# Altium project Invertor_controller_v2.PrjPcb (part 2 of 3)

## Sheet Power.SchDoc
size A4
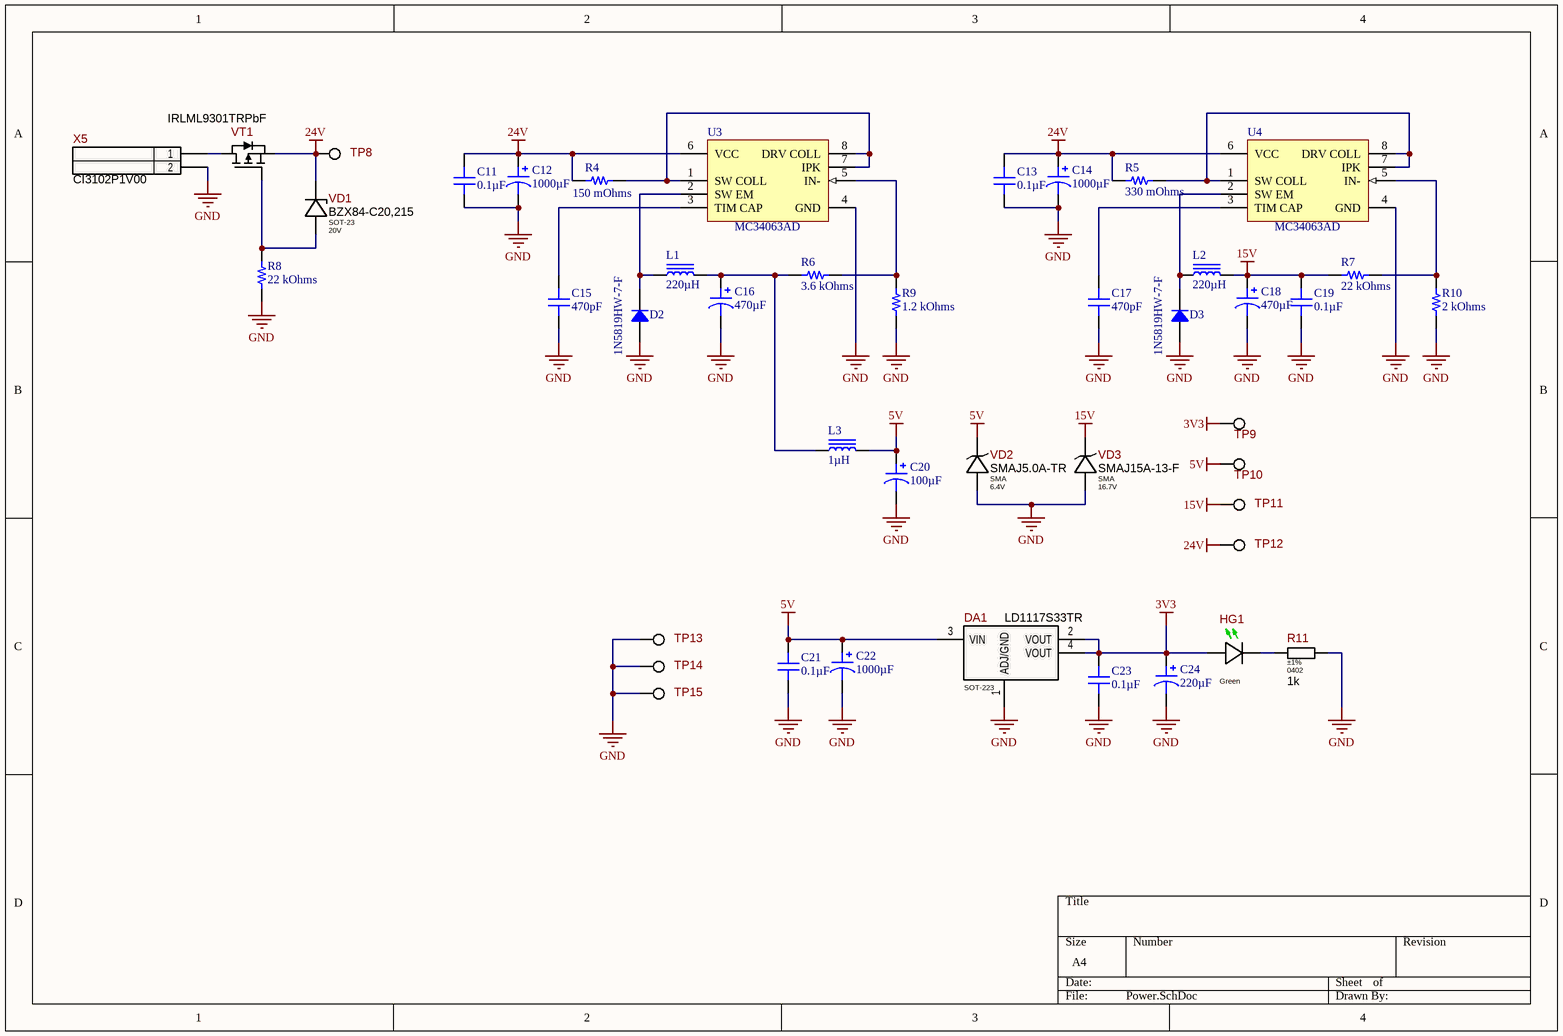
[diagram p3: Power.SchDoc]

### Parts
C11  0.1µF  [CAP 0805_2012]
C12  1000µF  [CAP TH ALUM ELEC D22.00mm S10.00mm H27.00mm]
C13  0.1µF  [CAP 0805_2012]
C14  1000µF  [CAP TH ALUM ELEC D22.00mm S10.00mm H27.00mm]
C15  470pF  [CAP 0805_2012]
C16  470µF  [CAP TH ALUM ELEC D8.00mm S3.50mm H12.50mm]
C17  470pF  [CAP 0805_2012]
C18  470µF  [CAP TH ALUM ELEC D8.00mm S3.50mm H12.50mm]
C19  0.1µF  [CAP 0805_2012]
C20  100µF  [CAP ALSMD 5.3MM H5.4MM]
C21  0.1µF  [CAP 0805_2012]
C22  1000µF  [CAP TH ALUM ELEC D22.00mm S10.00mm H27.00mm]
C23  0.1µF  [CAP 0805_2012]
C24  220µF  [CAP ALSMD POLY 5.3MM H6.0MM]
D2  1N5819HW-7-F  [SOD-123]
D3  1N5819HW-7-F  [SOD-123]
DA1  LD1117S33TR  [SOT-223]
HG1  Color: Green  [LED-0603G-0.8mm]  (hidden comment: 19-21/GHC-YR1S2/3T)
L1  220µH  [BOURNS SRR1280]
L2  220µH  [BOURNS SRR1280]
L3  1µH  [TAIYO YUDEN NRS5030]
R4  150 mOhms  [RES 1206_3216]
R5  330 mOhms  [RES 1206_3216]
R6  3.6 kOhms  [RES 0805_2012]
R7  22 kOhms  [RES 0805_2012]
R8  22 kOhms  [RES 0805_2012]
R9  1.2 kOhms  [RES 0805_2012]
R10  2 kOhms  [RES 0805_2012]
R11  Tolerance: ±1%  Package: 0402  [R_ANY_CHIP_0402_MED]  (hidden comment: 1k)
TP8  PAD-1.1mm  [PAD-1.1mm]  (value not drawn)  (no BOM)
TP9  PAD-1.1mm  [PAD-1.1mm]  (value not drawn)  (no BOM)
TP10  PAD-1.1mm  [PAD-1.1mm]  (value not drawn)  (no BOM)
TP11  PAD-1.1mm  [PAD-1.1mm]  (value not drawn)  (no BOM)
TP12  PAD-1.1mm  [PAD-1.1mm]  (value not drawn)  (no BOM)
TP13  PAD-1.1mm  [PAD-1.1mm]  (value not drawn)  (no BOM)
TP14  PAD-1.1mm  [PAD-1.1mm]  (value not drawn)  (no BOM)
TP15  PAD-1.1mm  [PAD-1.1mm]  (value not drawn)  (no BOM)
U3  MC34063AD  [751-05_N]
U4  MC34063AD  [751-05_N]
VD1  Package: SOT-23  Voltage: 20V  [SOT-23_MED]  (hidden comment: BZX84-C20,215)
VD2  Package: SMA  Voltage: 6.4V  [SMA_MED]  (hidden comment: SMAJ5.0A)
VD3  Package: SMA  Voltage: 16.7V  [SMA_MED]  (hidden comment: SMAJ15A)
VT1  IRLML9301TRPbF  [SOT-23_MED]
X5  WH-02S  [WF-2S]  (value not drawn)

### Nets
3V3: C23.2 C24.1 DA1.2(VOUT) DA1.4(VOUT) HG1.AN(Anode) TP9.1
5V: C20.1 C21.2 C22.1 DA1.3(VIN) L3.2 TP10.1 VD2.CA  [project net PCF_VCC]
15V: C18.1 C19.2 L2.2 R7.1 TP11.1 VD3.CA
24V: C11.2 C12.1 C13.2 C14.1 R4.1 R5.1 TP8.1 TP12.1 U3.6(VCC) U4.6(VCC) VD1.3(Cathode) VT1.2(S)
GND: C11.1 C12.2 C13.1 C14.2 C15.1 C16.2 C17.1 C18.2 C19.1 C20.2 C21.1 C22.2 C23.1 C24.2 D2.1 D3.1 DA1.1(ADJ/GND) R8.1 R9.1 R10.1 R11.2 TP13.1 TP14.1 TP15.1 U3.4(GND) U4.4(GND) VD2.AN VD3.AN X5.2
NetC15_2: C15.2 U3.3(TIM_CAP)
NetC16_1: C16.1 L1.2 L3.1 R6.1
NetC17_2: C17.2 U4.3(TIM_CAP)
NetD2_2: D2.2 L1.1 U3.2(SW_EM)
NetD3_2: D3.2 L2.1 U4.2(SW_EM)
NetHG1_CA: HG1.CA(Cathode) R11.1
NetR4_2: R4.2 U3.1(SW_COLL) U3.7(IPK) U3.8(DRV_COLL)
NetR5_2: R5.2 U4.1(SW_COLL) U4.7(IPK) U4.8(DRV_COLL)
NetR6_2: R6.2 R9.2 U3.5(IN-)
NetR7_2: R7.2 R10.2 U4.5(IN-)
NetR8_2: R8.2 VD1.1(Anode) VT1.1(G)
NetVT1_3: VT1.3(D) X5.1

Not connected (* = marked no-connect by the designer): VD1 2(NC)

### Library data of the parts
C11 C13 C19 C21 C23 = CC0805MRX7R9BB104: CAP CER 0.1UF 50V X7R 0805; Manufacturer: Yageo; Tolerance: ±20%; Part Number: CC0805MRX7R9BB104; Value: 0.1µF; Applications: General Purpose; Capacitance: 0.1µF; ComponentLink1Description: Datasheet; ComponentLink1URL: https://www.yageo.com/upload/media/product/productsearch/datasheet/mlcc/UPY-GPHC_X7R_6.3V-to-50V_18.pdf; ComponentLink2Description: DigiKey Link; ComponentLink2URL: http://digikey.com/product-detail/en/yageo/CC0805MRX7R9BB104/311-4351-1-ND/8025440; Device Package: 0805 (2012 Metric); LastUpdated: 02.09.2020 01:04:42; Lifecycle Status: Active; Minimum Order: 1; Mounting Type: Surface Mount, MLCC; Operating Temperature: -55°C ~ 125°C; Package / Case: 0805 (2012 Metric); Packaging: TapeAndReel; PartId: 2475; Part Status: Active; Price: 0.02; Series: CC; Size / Dimension: 0.079" L x 0.049" W (2.00mm x 1.25mm); Supplier 1: DigiKey; Supplier Part Number 1: 311-4351-1-ND; Temperature Coefficient: X7R; Thickness (Max): 0.037" (0.95mm); Voltage - Rated: 50V
C12 C14 C22 = LKG1V102MESZCK: CAP ALUM 1000UF 20% 35V SNAP IN; Manufacturer: Nichicon; Lifetime @ Temp.: 1000 Hrs @ 85°C; Polarization: Polar; Ripple Current @ Low Frequency: 1A @ 120Hz; Part Number: LKG1V102MESZCK; Applications: Audio; Capacitance: 1000µF; ComponentLink1Description: Datasheet; ComponentLink1URL: http://nichicon-us.com/english/products/pdfs/e-lkg.pdf; ComponentLink2Description: DigiKey Link; ComponentLink2URL: http://digikey.com/product-detail/en/nichicon/LKG1V102MESZCK/493-17542-ND/7698947; Device Package: Radial, Can - Snap-In; Height - Seated (Max): 1.063" (27.00mm); LastUpdated: 02.09.2020 01:30:15; Lead Spacing: 0.394" (10.00mm); Lifecycle Status: Active; Minimum Order: 1; Mounting Type: Through Hole; Operating Temperature: -40°C ~ 85°C; Package / Case: Radial, Can - Snap-In; Packaging: Bulk; PartId: 10430; Part Status: Active; Price: 4.27; Series: LKG; Size / Dimension: 0.866" Dia (22.00mm); Supplier 1: DigiKey; Supplier Part Number 1: 493-17542-ND; Tolerance: ±20%; Value: 1000µF; Voltage - Rated: 35V
C15 C17 = C0805X471J5HACAUTO: CAP CER 0805 470PF 50V ULTRA STA; Manufacturer: KEMET; Temperature Coefficient: X8R; Tolerance: ±5%; Part Number: C0805X471J5HACAUTO; Value: 470pF; Applications: Automotive, Boardflex Sensitive; Capacitance: 470pF; ComponentLink1Description: Datasheet; ComponentLink1URL: https://api.kemet.com/component-edge/download/datasheet/C0805X471J5HACAUTO.pdf; ComponentLink2Description: DigiKey Link; ComponentLink2URL: http://digikey.com/product-detail/en/kemet/C0805X471J5HACAUTO/399-16874-1-ND/8324471; Device Package: 0805 (2012 Metric); Features: Low ESL, Soft Termination, High Temperature; LastUpdated: 02.09.2020 01:04:33; Lifecycle Status: Active; Minimum Order: 1; Mounting Type: Surface Mount, MLCC; Operating Temperature: -55°C ~ 150°C; Package / Case: 0805 (2012 Metric); Packaging: TapeAndReel; PartId: 7274; Part Status: Active; Price: 0.04; Ratings: AEC-Q200; Series: SMD Auto X8R HT150C Flex; Size / Dimension: 0.079" L x 0.049" W (2.00mm x 1.25mm); Supplier 1: DigiKey; Supplier Part Number 1: 399-16874-1-ND; Thickness (Max): 0.039" (0.98mm); Voltage - Rated: 50V
C16 C18 = ECA-1AHG471: CAP ALUM 470UF 20% 10V RADIAL; Manufacturer: Panasonic Electronic Components; Lifetime @ Temp.: 1000 Hrs @ 105°C; Polarization: Polar; Ripple Current @ High Frequency: 375mA @ 100kHz; Ripple Current @ Low Frequency: 250mA @ 120Hz; Part Number: ECA-1AHG471; Applications: General Purpose; Capacitance: 470µF; ComponentLink1Description: Datasheet; ComponentLink1URL: https://industrial.panasonic.com/cdbs/www-data/pdf/RDF0000/ABA0000C1215.pdf; ComponentLink2Description: DigiKey Link; ComponentLink2URL: http://digikey.com/product-detail/en/panasonic-electronic-components/ECA-1AHG471/P5520-ND/245119; Device Package: Radial, Can; Height - Seated (Max): 0.492" (12.50mm); LastUpdated: 07.09.2020 05:24:51; Lead Spacing: 0.138" (3.50mm); Lifecycle Status: Active; Minimum Order: 1; Mounting Type: Through Hole; Operating Temperature: -55°C ~ 105°C; Package / Case: Radial, Can; Packaging: Bulk; PartId: 7234; Part Status: Active; Price: 0.43; Series: NHG; Size / Dimension: 0.315" Dia (8.00mm); Supplier 1: DigiKey; Supplier Part Number 1: P5520-ND; Tolerance: ±20%; Value: 470µF; Voltage - Rated: 10V
C20 = 865090142005: CAP 100 UF 20% 6.3 V; Manufacturer: Würth Elektronik; Lifetime @ Temp.: 1000 Hrs @ 85°C; Polarization: Polar; Ripple Current @ High Frequency: 105mA @ 100kHz; Ripple Current @ Low Frequency: 70mA @ 120Hz; Surface Mount Land Size: 0.209" L x 0.209" W (5.30mm x 5.30mm); Voltage - Rated: 6.3V; Part Number: 865090142005; Applications: General Purpose; Capacitance: 100µF; ComponentLink1Description: Datasheet; ComponentLink1URL: https://katalog.we-online.de/pbs/datasheet/865090142005.pdf; ComponentLink2Description: DigiKey Link; ComponentLink2URL: http://digikey.com/product-detail/en/w-rth-elektronik/865090142005/732-8389-1-ND/5728346; Device Package: Radial, Can - SMD; Height - Seated (Max): 0.217" (5.50mm); LastUpdated: 02.09.2020 01:25:23; Lifecycle Status: Active; Minimum Order: 1; Mounting Type: Surface Mount; Operating Temperature: -40°C ~ 85°C; Package / Case: Radial, Can - SMD; Packaging: TapeAndReel; PartId: 7916; Part Status: Active; Price: 0.14; Series: WCAP-ASLU; Size / Dimension: 0.197" Dia (5.00mm); Supplier 1: DigiKey; Supplier Part Number 1: 732-8389-1-ND; Tolerance: ±20%; Value: 100µF
C24 = 6SVPE220MW: CAP ALUM POLY 220UF 20% 6.3V SMD; Manufacturer: Panasonic Electronic Components; ESR (Equivalent Series Resistance): 15mOhm; Lifetime @ Temp.: 2000 Hrs @ 105°C; Ripple Current @ High Frequency: 3.15A @ 100kHz; Ripple Current @ Low Frequency: 157.5mA @ 120Hz; Surface Mount Land Size: 0.209" L x 0.209" W (5.30mm x 5.30mm); Type: Polymer; Part Number: 6SVPE220MW; Applications: General Purpose; Capacitance: 220µF; ComponentLink1Description: Datasheet; ComponentLink1URL: http://industrial.panasonic.com/www-cgi/jvcr13pz.cgi?E+CI+4+AAB8002+6SVPE220MW+8+WW; ComponentLink2Description: DigiKey Link; ComponentLink2URL: http://digikey.com/product-detail/en/panasonic-electronic-components/6SVPE220MW/P16836CT-ND/4834392; Device Package: Radial, Can - SMD; Height - Seated (Max): 0.236" (6.00mm); LastUpdated: 02.09.2020 01:22:07; Lifecycle Status: Active; Minimum Order: 1; Mounting Type: Surface Mount; Operating Temperature: -55°C ~ 105°C; Package / Case: Radial, Can - SMD; Packaging: TapeAndReel; PartId: 1960; Part Status: Active; Price: 0.20; Series: OS-CON™, SVPE; Size / Dimension: 0.197" Dia (5.00mm); Supplier 1: DigiKey; Supplier Part Number 1: P16836CT-ND; Tolerance: ±20%; Value: 220µF; Voltage - Rated: 6.3V
D2 D3 = 1N5819HW-7-F: DIODE SCHOTTKY 40V 1A SOD123; Manufacturer: Diodes Incorporated; Capacitance @ Vr, F: 60pF @ 4V, 1MHz; Current - Reverse Leakage @ Vr: 1mA @ 40V; Speed: Fast Recovery =< 500ns, > 200mA (Io); Voltage - Forward (Vf) (Max) @ If: 450mV @ 1A; Part Number: 1N5819HW-7-F; ComponentLink1Description: Datasheet; ComponentLink1URL: https://www.diodes.com/assets/Datasheets/ds30217.pdf; ComponentLink2Description: DigiKey Link; ComponentLink2URL: http://digikey.com/product-detail/en/diodes-incorporated/1N5819HW-7-F/1N5819HW-FDICT-ND/815283; Current - Average Rectified (Io): 1A; Diode Type: Schottky; LastUpdated: 02.09.2020 01:19:08; Lifecycle Status: Active; Minimum Order: 1; Mounting Type: Surface Mount; Operating Temperature - Junction: -65°C ~ 125°C; Package / Case: SOD-123; Packaging: TapeAndReel; PartId: 2212; Part Status: Active; Price: 0.08; Series: -; Supplier 1: DigiKey; Supplier Part Number 1: 1N5819HW-FDICT-ND; Supplier Device Package: SOD-123; Voltage - DC Reverse (Vr) (Max): 40V
DA1 = LD1117S33TR: Adjustable and fixed low drop positive voltage regulator, 3.3V 800mA; Manufacturer: STMicroelectronics; Standard Lead Time: 10 Weeks; Component Status: Released; Replacement: NONE; Package: SOT-223; Part Number: LD1117S33TR; Part Type: Power / Linear Regulator; Component Type: SMD; Lifecycle: Mass Production; Temperature Range: 0°C ~ 125°C; ComponentLink1URL: https://www.st.com/content/ccc/resource/technical/document/datasheet/99/3b/7d/91/91/51/4b/be/CD00000544.pdf/files/CD00000544.pdf/jcr:content/translations/en.CD00000544.pdf; Supplier 1: Digi-Key; Supplier Part Number 1: 497-1242-2-ND; ComponentLink1Description: Datasheet
HG1 = 19-21/GHC-YR1S2/3T: Indication LED, Green 528nm, Clear, SMD 0603, Vf 2.7-3.7V, 112 - 285mcd @ 20mA, 110°; Manufacturer: Everlight Electronics Co.,Ltd; Ajax_1C_PN: NONE; Component Status: Released; Part Type: LED; Component Type: SMD; Lifecycle: RND Only; Package: 0603; Wavelength: 528nm; Temperature Range: -40°C ~ 85°C; ComponentLink1URL: https://media.digikey.com/pdf/Data%20Sheets/Everlight%20PDFs/19-21-GHC-YR1S2-3T.pdf; Supplier 1: Digi-Key; Supplier Part Number 1: 19-21/GHC-YR1S2/3T-ND; Replacement: NONE; ComponentLink1Description: Datasheet
L1 L2 = SRR1280-221K: FIXED IND 220UH 1.6A 400MOHM SMD; Manufacturer: Bourns Inc.; Current - Saturation: 1.7A; DC Resistance (DCR): 400mOhm Max; Frequency - Self Resonant: 3.4MHz; Inductance Frequency - Test: 100kHz; Material - Core: Ferrite; Q @ Freq: 24 @ 796kHz; Shielding: Shielded; Tolerance: ±10%; Type: Wirewound; Part Number: SRR1280-221K; ComponentLink1Description: Datasheet; ComponentLink1URL: https://www.bourns.com/docs/Product-Datasheets/SRR1280.pdf; ComponentLink2Description: DigiKey Link; ComponentLink2URL: http://digikey.com/product-detail/en/bourns-inc/SRR1280-221K/SRR1280-221KLCT-ND/2127436; Current Rating (Amps): 1.6A; Device Package: Nonstandard; Height - Seated (Max): 0.315" (8.00mm); Inductance: 220µH; LastUpdated: 02.09.2020 01:22:10; Lifecycle Status: Active; Minimum Order: 1; Mounting Type: Surface Mount; Operating Temperature: -40°C ~ 125°C; Package / Case: Nonstandard; Packaging: TapeAndReel; PartId: 21; Part Status: Active; Price: 0.65; Series: SRR1280; Size / Dimension: 0.492" L x 0.492" W (12.50mm x 12.50mm); Supplier 1: DigiKey; Supplier Part Number 1: SRR1280-221KLCT-ND; Value: 220µH
L3 = NRS5030T1R0NMGJV: FIXED IND 1UH 4A 19.5 MOHM SMD; Manufacturer: Taiyo Yuden; Current - Saturation: 6.6A; DC Resistance (DCR): 19.5mOhm Max; Frequency - Self Resonant: 110MHz; Inductance Frequency - Test: 100kHz; Material - Core: Ferrite; Shielding: Shielded; Tolerance: ±30%; Type: Wirewound; Part Number: NRS5030T1R0NMGJV; ComponentLink1Description: Datasheet; ComponentLink1URL: https://ds.yuden.co.jp/TYCOMPAS/ut/detail?pn=NRS5030T1R0NMGJV  &u=M; ComponentLink2Description: DigiKey Link; ComponentLink2URL: http://digikey.com/product-detail/en/taiyo-yuden/NRS5030T1R0NMGJV/587-3601-1-ND/4694110; Current Rating (Amps): 4A; Device Package: Nonstandard; Height - Seated (Max): 0.118" (3.00mm); Inductance: 1µH; LastUpdated: 02.09.2020 01:28:54; Lifecycle Status: Active; Minimum Order: 1; Mounting Type: Surface Mount; Operating Temperature: -40°C ~ 125°C; Package / Case: Nonstandard; Packaging: TapeAndReel; PartId: 3403; Part Status: Active; Price: 0.27; Ratings: AEC-Q200; Series: NR, S Type; Size / Dimension: 0.193" L x 0.193" W (4.90mm x 4.90mm); Supplier 1: DigiKey; Supplier Part Number 1: 587-3601-1-ND; Value: 1µH
R4 = WSL1206R1500FEA: RES 0.15 OHM 1% 1/4W 1206; Manufacturer: Vishay Dale; Power (Watts): 0.25W, 1/4W; Temperature Coefficient: ±75ppm/°C; Part Number: WSL1206R1500FEA; ComponentLink1Description: Datasheet; ComponentLink1URL: http://www.vishay.com/docs/30100/wsl.pdf; ComponentLink2Description: DigiKey Link; ComponentLink2URL: http://digikey.com/product-detail/en/vishay-dale/WSL1206R1500FEA/WSLC-.15CT-ND/713434; Composition: Metal Element; Device Package: 1206 (3216 Metric); Features: Anti-Sulfur, Automotive AEC-Q200, Current Sense, Moisture Resistant, Pulse Withstanding; Height - Seated (Max): 0.035" (0.89mm); LastUpdated: 02.09.2020 01:12:45; Lifecycle Status: Active; Minimum Order: 1; Number of Terminations: 2; Operating Temperature: -65°C ~ 170°C; Package / Case: 1206 (3216 Metric); Packaging: TapeAndReel; PartId: 37214; Part Status: Active; Price: 0.25; Ratings: AEC-Q200; Resistance: 150 mOhms; Series: WSL; Size / Dimension: 0.126" L x 0.063" W (3.20mm x 1.60mm); Supplier 1: DigiKey; Supplier Part Number 1: WSLC-.15CT-ND; Supplier Device Package: 1206; Tolerance: ±1%; Value: 150 mOhms
R5 = ERJ-8RQFR33V: RES 0.33 OHM 1% 1/4W 1206; Manufacturer: Panasonic Electronic Components; Power (Watts): 0.25W, 1/4W; Temperature Coefficient: ±250ppm/°C; Part Number: ERJ-8RQFR33V; ComponentLink1Description: Datasheet; ComponentLink1URL: https://industrial.panasonic.com/cdbs/www-data/pdf/RDN0000/AOA0000C313.pdf; ComponentLink2Description: DigiKey Link; ComponentLink2URL: http://digikey.com/product-detail/en/panasonic-electronic-components/ERJ-8RQFR33V/P.33RCT-ND/250350; Composition: Thick Film; Device Package: 1206 (3216 Metric); Features: Automotive AEC-Q200, Current Sense; Height - Seated (Max): 0.028" (0.70mm); LastUpdated: 02.09.2020 01:13:10; Lifecycle Status: Active; Minimum Order: 1; Number of Terminations: 2; Operating Temperature: -55°C ~ 125°C; Package / Case: 1206 (3216 Metric); Packaging: TapeAndReel; PartId: 26973; Part Status: Active; Price: 0.04; Ratings: AEC-Q200; Resistance: 330 mOhms; Series: ERJ; Size / Dimension: 0.126" L x 0.063" W (3.20mm x 1.60mm); Supplier 1: DigiKey; Supplier Part Number 1: P.33RCT-ND; Supplier Device Package: 1206; Tolerance: ±1%; Value: 330 mOhms
R6 = RMCF0805FT3K60: RES 3.6K OHM 1% 1/8W 0805; Manufacturer: Stackpole Electronics Inc; Power (Watts): 0.125W, 1/8W; Temperature Coefficient: ±100ppm/°C; Part Number: RMCF0805FT3K60; Value: 3.6 kOhms; ComponentLink1Description: Datasheet; ComponentLink1URL: https://www.seielect.com/catalog/sei-rmcf_rmcp.pdf; ComponentLink2Description: DigiKey Link; ComponentLink2URL: http://digikey.com/product-detail/en/stackpole-electronics-inc/RMCF0805FT3K60/RMCF0805FT3K60CT-ND/2418390; Composition: Thick Film; Device Package: 0805 (2012 Metric); Features: Automotive AEC-Q200; Height - Seated (Max): 0.026" (0.65mm); LastUpdated: 02.09.2020 01:15:14; Lifecycle Status: Active; Minimum Order: 1; Number of Terminations: 2; Operating Temperature: -55°C ~ 155°C; Package / Case: 0805 (2012 Metric); Packaging: CutTape; PartId: 32503; Part Status: Active; Price: 0.10; Ratings: AEC-Q200; Resistance: 3.6 kOhms; Series: RMCF; Size / Dimension: 0.079" L x 0.049" W (2.00mm x 1.25mm); Supplier 1: DigiKey; Supplier Part Number 1: RMCF0805FT3K60CT-ND; Supplier Device Package: 0805; Tolerance: ±1%
R7 R8 = ERA-6AED223V: RES 22K OHM 0.5% 1/8W 0805; Manufacturer: Panasonic Electronic Components; Power (Watts): 0.125W, 1/8W; Temperature Coefficient: ±25ppm/°C; Part Number: ERA-6AED223V; Value: 22 kOhms; ComponentLink1Description: Datasheet; ComponentLink1URL: https://industrial.panasonic.com/cdbs/www-data/pdf/RDM0000/AOA0000C307.pdf; ComponentLink2Description: DigiKey Link; ComponentLink2URL: http://digikey.com/product-detail/en/panasonic-electronic-components/ERA-6AED223V/P123824CT-ND/9467753; Composition: Thin Film; Device Package: 0805 (2012 Metric); Features: Automotive AEC-Q200; Height - Seated (Max): 0.024" (0.60mm); LastUpdated: 02.09.2020 01:15:15; Lifecycle Status: Active; Minimum Order: 1; Number of Terminations: 2; Operating Temperature: -55°C ~ 155°C; Package / Case: 0805 (2012 Metric); Packaging: TapeAndReel; PartId: 31813; Part Status: Active; Price: 0.01; Ratings: AEC-Q200; Resistance: 22 kOhms; Series: ERA-6A; Size / Dimension: 0.079" L x 0.049" W (2.00mm x 1.25mm); Supplier 1: DigiKey; Supplier Part Number 1: P123824CT-ND; Supplier Device Package: 0805; Tolerance: ±0.5%
R9 = CRGP0805F1K2: CRGP 0805 1K2 1%; Manufacturer: TE Connectivity Passive Product; Power (Watts): 0.333W, 1/3W; Temperature Coefficient: ±100ppm/°C; Part Number: CRGP0805F1K2; Value: 1.2 kOhms; ComponentLink1Description: Datasheet; ComponentLink1URL: https://www.te.com/commerce/DocumentDelivery/DDEController?Action=srchrtrv&DocNm=9-1773463-9&DocType=DS&DocLang=English; ComponentLink2Description: DigiKey Link; ComponentLink2URL: http://digikey.com/product-detail/en/te-connectivity-passive-product/CRGP0805F1K2/A130478CT-ND/8578310; Composition: Thick Film; Device Package: 0805 (2012 Metric); Features: Pulse Withstanding; Height - Seated (Max): 0.026" (0.65mm); LastUpdated: 02.09.2020 01:15:22; Lifecycle Status: Active; Minimum Order: 1; Number of Terminations: 2; Operating Temperature: -55°C ~ 155°C; Package / Case: 0805 (2012 Metric); Packaging: TapeAndReel; PartId: 28792; Part Status: Active; Price: 0.02; Resistance: 1.2 kOhms; Series: CRGP; Size / Dimension: 0.079" L x 0.049" W (2.00mm x 1.25mm); Supplier 1: DigiKey; Supplier Part Number 1: A130478CT-ND; Supplier Device Package: 0805; Tolerance: ±1%
R10 = RCS08052K00FKEA: RES SMD 2K OHM 1% 0.4W 0805; Manufacturer: Vishay Dale; Power (Watts): 0.4W, 2/5W; Temperature Coefficient: ±100ppm/°C; Part Number: RCS08052K00FKEA; Value: 2 kOhms; ComponentLink1Description: Datasheet; ComponentLink1URL: http://www.vishay.com/docs/20065/rcse3.pdf; ComponentLink2Description: DigiKey Link; ComponentLink2URL: http://digikey.com/product-detail/en/vishay-dale/RCS08052K00FKEA/541-2840-1-ND/5867133; Composition: Thick Film; Device Package: 0805 (2012 Metric); Features: Automotive AEC-Q200, Pulse Withstanding; Height - Seated (Max): 0.020" (0.50mm); LastUpdated: 02.09.2020 01:15:24; Lifecycle Status: Active; Minimum Order: 1; Number of Terminations: 2; Operating Temperature: -55°C ~ 155°C; Package / Case: 0805 (2012 Metric); Packaging: TapeAndReel; PartId: 27786; Part Status: Active; Price: 0.03; Ratings: AEC-Q200; Resistance: 2 kOhms; Series: RCS e3; Size / Dimension: 0.079" L x 0.049" W (2.00mm x 1.25mm); Supplier 1: DigiKey; Supplier Part Number 1: 541-2840-1-ND; Supplier Device Package: 0805; Tolerance: ±1%
R11 = RC0402FR-071KL: 1 kOhms ±1% 1/16W 0402 Thick Film Resistor; Manufacturer: Yageo; Ajax_1C_ID: 4845; Ajax_1C_PN: 1k 1% 0402 Resistors SMD RoHS; Power Rating: 0.062W; Voltage: 50V; Temperature Stability: ±100ppm/°C; Replacement: NONE; Value: 1k; Part Number: RC0402FR-071KL; Component Type: SMD; Lifecycle: Mass Production; Temperature Range: -55°C ~ 155°C; ComponentLink1URL: https://www.yageo.com/upload/media/product/productsearch/datasheet/rchip/PYu-RC_Group_51_RoHS_L_10.pdf; Supplier 1: Digi-Key; Supplier Part Number 1: 311-1.00KLRTR-ND; ComponentLink1Description: Datasheet
TP8-TP15 = PAD-1.1mm: 1.1mm Pad for Plug-In or Receptacle; Ajax_1C_PN: NONE; Ajax_1С_Status: RND Only; Component Status: Released; Lifecycle: ="Lifecycle"; Part Number: PAD-1.1mm; Component Type: PTH; Manufacturer: NONE; Part Type: Pad; Temperature Range: NONE; ComponentLink1URL: NONE; Replacement: NONE; Price: NONE; ComponentLink1Description: Datasheet
U3 U4 = MC34063AD: DC-to-DC Converter Control Circuit; Published: 15-Apr-2002; LatestRevisionDate: 13-Apr-2006; LatestRevisionNote: IPC-7351 Footprint Added.; DatasheetVersion: 1996; PackageVersion: 1998; PackageReference: 751-05; Publisher: Altium Limited; PackageDescription: 8-Pin Small Outline Integrated Circuit 1.27 mm Pitch; Code_JEDEC: MS-012-AA; Code_IPC: SOIC127P600-8; ComponentLink1Description: Manufacturer Link; ComponentLink1URL: http://www.onsemi.com/site/products/taxonomy/0,4438,503,00.html; ComponentLink2Description: Datasheet; ComponentLink2URL: http://www.onsemi.com/pub/Collateral/MC34063A-D.PDF
VD1 = BZX84-C20,215: Zener Diode 20V, 250mW, ±5%, SOT-23; Manufacturer: Nexperia USA Inc.; Ajax_1C_PN: NONE; Ajax_1С_Status: RND Only; Marking: Y7*; Component Status: Released; Standard Lead Time: 27 Weeks; Part Number: BZX84-C20,215; Part Type: Zener; Component Type: SMD; Temperature Range: -55°C ~ 150°C; ComponentLink1URL: https://static6.arrow.com/aropdfconversion/37b1ab3b8b48176cf8bfe8250c7c247c7c00f45/bzx84_ser.pdf; Supplier 1: Arrow; Supplier Part Number 1: BZX84-C20,215; Replacement: NONE; Price: NONE; ComponentLink1Description: Datasheet
VD2 = SMAJ5.0A-TR: TVS Diode 13.4V Clamp, 174A (8/20µs) Ipp, SMA; Manufacturer: STMicroelectronics; Ajax_1C_PN: NONE; Ajax_1С_Status: RND Only; Marking: AE; Component Status: Released; Standard Lead Time: 17 Weeks; Part Number: SMAJ5.0A-TR; Part Type: TVS / ESD Protection; Component Type: SMD; Current: 174A; Temperature Range: -55°C ~ 150°C; ComponentLink1URL: https://www.st.com/content/ccc/resource/technical/document/datasheet/ff/c0/80/cc/19/4c/45/af/CD00001333.pdf/files/CD00001333.pdf/_jcr_content/translations/en.CD00001333.pdf; Supplier 1: Digi-Key; Supplier Part Number 1: 497-2999-2-ND; Replacement: NONE; Price: NONE; ComponentLink1Description: Datasheet
VD3 = SMAJ15A-13-F: TVS Diode 24.4V Clamp, 16.4A (10/1000 µs) Ipp, SMA; Manufacturer: Diodes Incorporated; Ajax_1C_ID: 22754; Ajax_1C_PN: SMAJ15A-13-F диод Diodes Incorporated; Ajax_1С_Status: Mass Production; Marking: IM; Component Status: Released; Standard Lead Time: 32 Weeks; Replacement: NONE; GUID_1C: 53f7ae03-0954-11eb-ab65-0050569f2651; Part Number: SMAJ15A-13-F; Part Type: TVS / ESD Protection; Component Type: SMD; Current: 16.4A; Temperature Range: -55°C ~ 150°C; ComponentLink1URL: https://eu.mouser.com/datasheet/2/115/DIOD_S_A0011538071_1-2543697.pdf; Supplier 1: Mouser; Supplier Part Number 1: 621-SMAJ15A-13-F; Price: 0,039; ComponentLink1Description: Datasheet
VT1 = IRLML9301TRPbF: -30V, -3.6A max P-Channel HEXFET MOSFET, 82mOhm @ Vgs = -4.5V; Manufacturer: Infineon Technologies; Vds: 30V; Id: 3.6A; Rds: 103mOhm; Ajax_1C_ID: 18293; Ajax_1C_PN: IRLML9301TRPBF SOT-23-3; Ajax_1С_Status: RND Only; Component Status: Released; Standard Lead Time: 77 Weeks; Replacement: NONE; GUID_1C: 9e524eff-1dcc-11ea-ab59-0050569f2651; Part Number: IRLML9301TRPbF; Package: SOT-23; Part Type: P-Channel; Component Type: SMD; Temperature Range: -55°C ~ 150°C; ComponentLink1URL: https://eu.mouser.com/datasheet/2/196/Infineon_IRLML9301_DataSheet_v01_01_EN-1732998.pdf; Supplier 1: Mouser; Supplier Part Number 1: IRLML9301TRPbF; Price: 0,05744444; ComponentLink1Description: Datasheet
X5 = CI3102P1V00: WH Series 2.54mm Wire to Board Straight DIP Type Headers, 2-Pin; Manufacturer: CviLux; Ajax_1C_PN: NONE; Part Number: CI3102P1V00; Part Type: Wire-to-Board; Component Type: PTH; Lifecycle: RND Only; Temperature Range: -25℃ ~ 85℃; ComponentLink1URL: https://www.cvilux.com/uploads/drawings/100/723/CI3102S.pdf; Replacement: NONE; ComponentLink1Description: Datasheet

## Sheet Divider9.SchDoc
size A4
Used 4 times, as channels Designator, Designator, Designator, Designator. Parts and nets are listed once, with the designators drawn on the sheet.
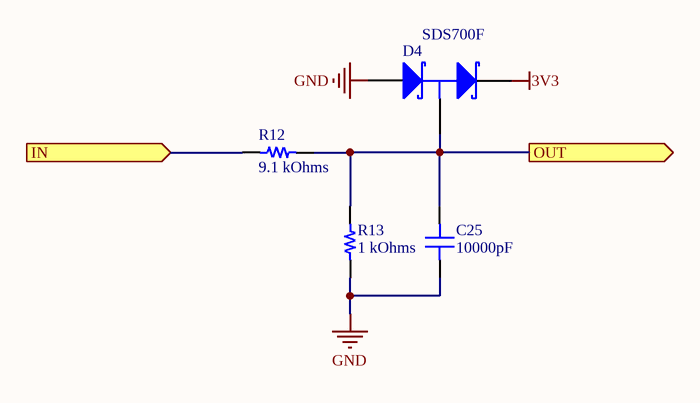
[diagram p4: Divider9.SchDoc]

### Parts
C25  10000pF  [CAP 0805_2012]
D4  SDS700F  [SOT323_N]
R12  9.1 kOhms  [RES 0805_2012]
R13  1 kOhms  [RES 0805_2012]

### Ports
IN (in), OUT (out)

### Nets
3V3: D4.2(K)
GND: C25.1 D4.1(A) R13.1
IN: R12.1 ; port IN
OUT: C25.2 D4.3(C) R12.2 R13.2 ; port OUT

### Channels
Designator: designators end in _Designator#1; ports IN=24V_BAT OUT=AIN0
Designator: designators end in _Designator#2; ports IN=x24V_DC_AC OUT=AIN1
Designator: designators end in _Designator#3; ports IN=NetR12_Designator#3_1 OUT=AIN3
Designator: designators end in _Designator#4; ports IN=NetR12_Designator#4_1 OUT=AIN4

### Library data of the parts
C25 = C0805C103KCRACAUTO: CAP CER 0805 10NF 500V X7R 10%; Manufacturer: KEMET; Part Number: C0805C103KCRACAUTO; Value: 10000pF; Applications: Automotive, Bypass, Decoupling; Capacitance: 10000pF; ComponentLink1Description: Datasheet; ComponentLink1URL: https://api.kemet.com/component-edge/download/datasheet/C0805C103KCRACAUTO.pdf; ComponentLink2Description: DigiKey Link; ComponentLink2URL: http://digikey.com/product-detail/en/kemet/C0805C103KCRACAUTO/399-16644-1-ND/8110010; Device Package: 0805 (2012 Metric); Features: Low ESL, High Voltage; LastUpdated: 02.09.2020 01:04:20; Lifecycle Status: Active; Minimum Order: 1; Mounting Type: Surface Mount, MLCC; Operating Temperature: -55°C ~ 125°C; Package / Case: 0805 (2012 Metric); Packaging: TapeAndReel; PartId: 14123; Part Status: Active; Price: 0.06; Ratings: AEC-Q200; Series: SMD Auto X7R HV; Size / Dimension: 0.079" L x 0.049" W (2.00mm x 1.25mm); Supplier 1: DigiKey; Supplier Part Number 1: 399-16644-1-ND; Temperature Coefficient: X7R; Thickness (Max): 0.055" (1.40mm); Tolerance: ±10%; Voltage - Rated: 500V
D4 = BAT854SW: Schottky Barrier Double Diode; Published: 17-Sep-2003; LatestRevisionDate: 12-Dec-2006; LatestRevisionNote: IPC-7351 Footprint Added.; DatasheetVersion: 27-Feb-2001; PackageVersion: Apr-1999; PackageReference: SOT323; Publisher: Altium Limited; PackageDescription: 3-Pin SOT-323 Package 0.65 mm Pitch, 2.1 mm Lead Span; ComponentLink1Description: Manufacturer Link; ComponentLink1URL: http://www.semiconductors.philips.com/; ComponentLink2Description: Datasheet; ComponentLink2URL: http://www.semiconductors.philips.com/acrobat/datasheets/BAT854W_SERIES_1.pdf
R12 = CR0805-FX-9101ELF: RES SMD 9.1K OHM 1% 1/8W 0805; Manufacturer: Bourns Inc.; Power (Watts): 0.125W, 1/8W; Temperature Coefficient: ±100ppm/°C; Part Number: CR0805-FX-9101ELF; Value: 9.1 kOhms; ComponentLink1Description: Datasheet; ComponentLink1URL: https://www.bourns.com/docs/Product-Datasheets/CHPREZTR.pdf; ComponentLink2Description: DigiKey Link; ComponentLink2URL: http://digikey.com/product-detail/en/bourns-inc/CR0805-FX-9101ELF/118-CR0805-FX-9101ELFCT-ND/10673708; Composition: Thick Film; Device Package: 0805 (2012 Metric); Features: Moisture Resistant; Height - Seated (Max): 0.024" (0.60mm); LastUpdated: 02.09.2020 01:15:15; Lifecycle Status: Active; Minimum Order: 1; Number of Terminations: 2; Operating Temperature: -55°C ~ 155°C; Package / Case: 0805 (2012 Metric); Packaging: TapeAndReel; PartId: 32150; Part Status: Active; Price: 0.01; Resistance: 9.1 kOhms; Series: CR0805; Size / Dimension: 0.079" L x 0.049" W (2.00mm x 1.25mm); Supplier 1: DigiKey; Supplier Part Number 1: 118-CR0805-FX-9101ELFCT-ND; Supplier Device Package: 0805; Tolerance: ±1%
R13 = ESR10EZPF1001: RES SMD 1K OHM 1% 0.4W 0805; Manufacturer: Rohm Semiconductor; Power (Watts): 0.4W, 2/5W; Temperature Coefficient: ±100ppm/°C; Part Number: ESR10EZPF1001; Value: 1 kOhms; ComponentLink1Description: Datasheet; ComponentLink1URL: https://www.rohm.com/datasheet/ESR01MZPF/esr-e; ComponentLink2Description: DigiKey Link; ComponentLink2URL: http://digikey.com/product-detail/en/rohm-semiconductor/ESR10EZPF1001/RHM1.00KAECT-ND/1983804; Composition: Thick Film; Device Package: 0805 (2012 Metric); Features: Automotive AEC-Q200, Pulse Withstanding; Height - Seated (Max): 0.026" (0.65mm); LastUpdated: 02.09.2020 01:15:23; Lifecycle Status: Active; Minimum Order: 1; Number of Terminations: 2; Operating Temperature: -55°C ~ 155°C; Package / Case: 0805 (2012 Metric); Packaging: TapeAndReel; PartId: 28032; Part Status: Active; Price: 0.02; Ratings: AEC-Q200; Resistance: 1 kOhms; Series: ESR; Size / Dimension: 0.079" L x 0.049" W (2.00mm x 1.25mm); Supplier 1: DigiKey; Supplier Part Number 1: RHM1.00KAECT-ND; Supplier Device Package: 0805; Tolerance: ±1%

## Sheet ShuntAmplifier.SchDoc
size A4
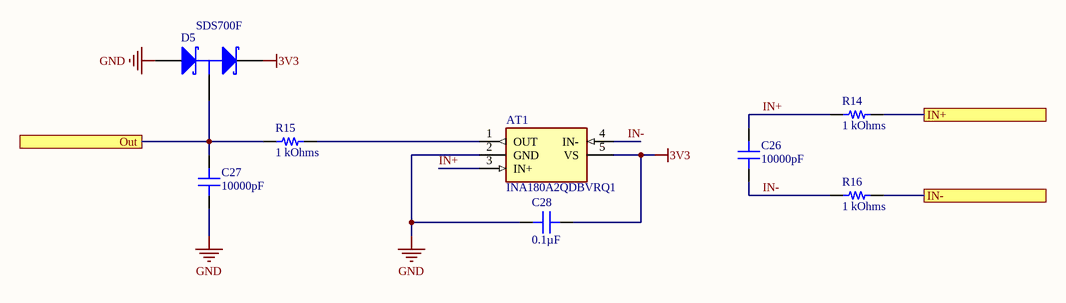
[diagram p5: ShuntAmplifier.SchDoc]

### Parts
AT1  INA180A2QDBVRQ1  [SOT95P280X145-5N]
C26  10000pF  [CAP 0805_2012]
C27  10000pF  [CAP 0805_2012]
C28  0.1µF  [CAP 0805_2012]
D5  SDS700F  [SOT323_N]
R14  1 kOhms  [RES 0805_2012]
R15  1 kOhms  [RES 0805_2012]
R16  1 kOhms  [RES 0805_2012]

### Ports
IN+, IN-, Out

### Nets
3V3: AT1.5(VS) C28.1 D5.2(K)
GND: AT1.2(GND) C27.1 C28.2 D5.1(A)
IN+: AT1.3(IN+) C26.2 R14.2
IN-: AT1.4(IN-) C26.1 R16.2
SHUNT+: R14.1 ; port IN+
SHUNT-: R16.1 ; port IN-
xBAT_CURRENT: C27.2 D5.3(C) R15.2 ; port Out
NetAT1_1: AT1.1(OUT) R15.1

### Library data of the parts
AT1 = INA180A2QDBVRQ1: Attenuator or Isolator; Manufacturer_Name: Texas Instruments; Datasheet Link: http://www.ti.com/lit/gpn/INA180-Q1; Height: 1.45mm; Manufacturer_Part_Number: INA180A2QDBVRQ1; Mouser Part Number: 595-INA180A2QDBVRQ1; Mouser Price/Stock: https://www.mouser.co.uk/ProductDetail/Texas-Instruments/INA180A2QDBVRQ1?qs=9r4v7xj2LnnPs8OEye75UA%3D%3D; Arrow Part Number: INA180A2QDBVRQ1; Arrow Price/Stock: https://www.arrow.com/en/products/ina180a2qdbvrq1/texas-instruments
C26 C27 = C0805C103KCRACAUTO: as C25 on sheet Divider9; Part Number: C0805C103KCRACAUTO; Value: 10000pF; Applications: Automotive, Bypass, Decoupling; Capacitance: 10000pF; ComponentLink1Description: Datasheet; ComponentLink1URL: https://api.kemet.com/component-edge/download/datasheet/C0805C103KCRACAUTO.pdf; ComponentLink2Description: DigiKey Link; ComponentLink2URL: http://digikey.com/product-detail/en/kemet/C0805C103KCRACAUTO/399-16644-1-ND/8110010; Device Package: 0805 (2012 Metric); Features: Low ESL, High Voltage; LastUpdated: 02.09.2020 01:04:20; Lifecycle Status: Active; Minimum Order: 1; Mounting Type: Surface Mount, MLCC; Operating Temperature: -55°C ~ 125°C; Package / Case: 0805 (2012 Metric); Packaging: TapeAndReel; PartId: 14123; Part Status: Active; Price: 0.06; Ratings: AEC-Q200; Series: SMD Auto X7R HV; Size / Dimension: 0.079" L x 0.049" W (2.00mm x 1.25mm); Supplier 1: DigiKey; Supplier Part Number 1: 399-16644-1-ND; Temperature Coefficient: X7R; Thickness (Max): 0.055" (1.40mm); Tolerance: ±10%; Voltage - Rated: 500V
C28 = CC0805MRX7R9BB104: as C11 on sheet Power; Part Number: CC0805MRX7R9BB104; Value: 0.1µF; Applications: General Purpose; Capacitance: 0.1µF; ComponentLink1Description: Datasheet; ComponentLink1URL: https://www.yageo.com/upload/media/product/productsearch/datasheet/mlcc/UPY-GPHC_X7R_6.3V-to-50V_18.pdf; ComponentLink2Description: DigiKey Link; ComponentLink2URL: http://digikey.com/product-detail/en/yageo/CC0805MRX7R9BB104/311-4351-1-ND/8025440; Device Package: 0805 (2012 Metric); LastUpdated: 02.09.2020 01:04:42; Lifecycle Status: Active; Minimum Order: 1; Mounting Type: Surface Mount, MLCC; Operating Temperature: -55°C ~ 125°C; Package / Case: 0805 (2012 Metric); Packaging: TapeAndReel; PartId: 2475; Part Status: Active; Price: 0.02; Series: CC; Size / Dimension: 0.079" L x 0.049" W (2.00mm x 1.25mm); Supplier 1: DigiKey; Supplier Part Number 1: 311-4351-1-ND; Temperature Coefficient: X7R; Thickness (Max): 0.037" (0.95mm); Voltage - Rated: 50V
D5 = BAT854SW: Schottky Barrier Double Diode; Published: 17-Sep-2003; LatestRevisionDate: 12-Dec-2006; LatestRevisionNote: IPC-7351 Footprint Added.; DatasheetVersion: 27-Feb-2001; PackageVersion: Apr-1999; PackageReference: SOT323; Publisher: Altium Limited; PackageDescription: 3-Pin SOT-323 Package 0.65 mm Pitch, 2.1 mm Lead Span; ComponentLink1Description: Manufacturer Link; ComponentLink1URL: http://www.semiconductors.philips.com/; ComponentLink2Description: Datasheet; ComponentLink2URL: http://www.semiconductors.philips.com/acrobat/datasheets/BAT854W_SERIES_1.pdf
R14-R16 = ESR10EZPF1001: as R13 on sheet Divider9; Part Number: ESR10EZPF1001; Value: 1 kOhms; ComponentLink1Description: Datasheet; ComponentLink1URL: https://www.rohm.com/datasheet/ESR01MZPF/esr-e; ComponentLink2Description: DigiKey Link; ComponentLink2URL: http://digikey.com/product-detail/en/rohm-semiconductor/ESR10EZPF1001/RHM1.00KAECT-ND/1983804; Composition: Thick Film; Device Package: 0805 (2012 Metric); Features: Automotive AEC-Q200, Pulse Withstanding; Height - Seated (Max): 0.026" (0.65mm); LastUpdated: 02.09.2020 01:15:23; Lifecycle Status: Active; Minimum Order: 1; Number of Terminations: 2; Operating Temperature: -55°C ~ 155°C; Package / Case: 0805 (2012 Metric); Packaging: TapeAndReel; PartId: 28032; Part Status: Active; Price: 0.02; Ratings: AEC-Q200; Resistance: 1 kOhms; Series: ESR; Size / Dimension: 0.079" L x 0.049" W (2.00mm x 1.25mm); Supplier 1: DigiKey; Supplier Part Number 1: RHM1.00KAECT-ND; Supplier Device Package: 0805; Tolerance: ±1%

## Sheet FusesControl.SchDoc
size A4
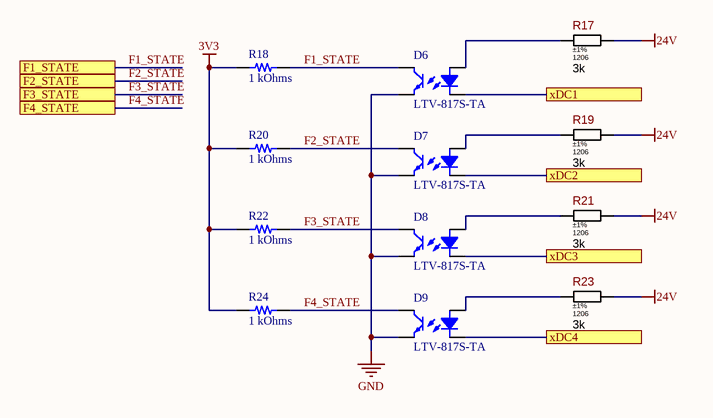
[diagram p6: FusesControl.SchDoc]

### Parts
D6  LTV-817S-TA  [LITEON LTV-817]
D7  LTV-817S-TA  [LITEON LTV-817]
D8  LTV-817S-TA  [LITEON LTV-817]
D9  LTV-817S-TA  [LITEON LTV-817]
R17  Tolerance: ±1%  Package: 1206  [R_ANY_CHIP_1206_MED]  (hidden comment: 3k)
R18  1 kOhms  [RES 0805_2012]
R19  Tolerance: ±1%  Package: 1206  [R_ANY_CHIP_1206_MED]  (hidden comment: 3k)
R20  1 kOhms  [RES 0805_2012]
R21  Tolerance: ±1%  Package: 1206  [R_ANY_CHIP_1206_MED]  (hidden comment: 3k)
R22  1 kOhms  [RES 0805_2012]
R23  Tolerance: ±1%  Package: 1206  [R_ANY_CHIP_1206_MED]  (hidden comment: 3k)
R24  1 kOhms  [RES 0805_2012]

### Ports
F1_STATE, F2_STATE, F3_STATE, F4_STATE, xDC1, xDC2, xDC3, xDC4

### Nets
3V3: R18.2 R20.2 R22.2 R24.2
24V: R17.2 R19.2 R21.2 R23.2
GND: D6.3 D7.3 D8.3 D9.3
F1_STATE: D6.4 R18.1 ; port F1_STATE
F2_STATE: D7.4 R20.1 ; port F2_STATE
F3_STATE: D8.4 R22.1 ; port F3_STATE
F4_STATE: D9.4 R24.1 ; port F4_STATE
NetD6_1: D6.1 R17.1
NetD6_2: D6.2 ; port xDC1
NetD7_1: D7.1 R19.1
NetD7_2: D7.2 ; port xDC2
NetD8_1: D8.1 R21.1
NetD8_2: D8.2 ; port xDC3
NetD9_1: D9.1 R23.1
NetD9_2: D9.2 ; port xDC4

### Library data of the parts
D6-D9 = LTV-817S-TA: OPTOISOLATR 5KV TRANSISTOR 4-SMD; Manufacturer: Lite-On Inc.; Current - DC Forward (If) (Max): 50mA; Current Transfer Ratio (Max): 600% @ 5mA; Current Transfer Ratio (Min): 50% @ 5mA; Input Type: DC; Number of Channels: 1; Rise / Fall Time (Typ): 4µs, 3µs; Vce Saturation (Max): 200mV; Voltage - Forward (Vf) (Typ): 1.2V; Voltage - Isolation: 5000Vrms; Voltage - Output (Max): 35V; Part Number: LTV-817S-TA; ComponentLink1Description: Datasheet; ComponentLink1URL: http://optoelectronics.liteon.com/upload/download/DS-70-96-0016/LTV-8X7%20series%20201610%20.pdf; ComponentLink2Description: DigiKey Link; ComponentLink2URL: http://digikey.com/product-detail/en/lite-on-inc/LTV-817S-TA/160-2038-1-ND/3711420; Current - Output / Channel: 50mA; Device Package: 4-SMD, Gull Wing; LastUpdated: 12.01.2020 21:59:02; Lifecycle Status: Active; Minimum Order: 1; Mounting Type: Surface Mount; Operating Temperature: -30°C ~ 110°C; Output Type: Transistor; Package / Case: 4-SMD, Gull Wing; Packaging: TapeAndReel; Part Status: Active; Price: 0.12; Series: -; Supplier 1: DigiKey; Supplier Part Number 1: 160-2038-1-ND; Supplier Device Package: 4-SMD
R17 R19 R21 R23 = RC1206FR-073KL: 3 kOhms ±1%, 1/4W 1206 Thick Film Resistor; Manufacturer: Yageo; Ajax_1C_PN: NONE; Power Rating: 0.25W; Voltage: 200V; Temperature Stability: ±100ppm/°C; Value: 3k; Part Number: RC1206FR-073KL; Component Type: SMD; Lifecycle: RND Only; Temperature Range: -55°C ~ 155°C; ComponentLink1URL: https://www.yageo.com/upload/media/product/productsearch/datasheet/rchip/PYu-RC_Group_51_RoHS_L_11.pdf; Supplier 1: Digi-Key; Supplier Part Number 1: 311-3.00KFRTR-ND; Replacement: NONE; ComponentLink1Description: Datasheet
R18 R20 R22 R24 = RNCS0805BKE1K00: RES 1K OHM 0.1% 1/10W 0805; Manufacturer: Stackpole Electronics Inc; Power (Watts): 0.1W, 1/10W; Temperature Coefficient: ±25ppm/°C; Part Number: RNCS0805BKE1K00; Value: 1 kOhms; ComponentLink1Description: Datasheet; ComponentLink1URL: https://www.seielect.com/catalog/sei-rncs_rnch.pdf; ComponentLink2Description: DigiKey Link; ComponentLink2URL: http://digikey.com/product-detail/en/stackpole-electronics-inc/RNCS0805BKE1K00/RNCS0805BKE1K00CT-ND/1800170; Composition: Thin Film; Device Package: 0805 (2012 Metric); Features: Anti-Corrosive, Automotive AEC-Q200, Moisture Resistant; Height - Seated (Max): 0.026" (0.65mm); LastUpdated: 02.09.2020 01:15:24; Lifecycle Status: Active; Minimum Order: 1; Number of Terminations: 2; Operating Temperature: -55°C ~ 155°C; Package / Case: 0805 (2012 Metric); Packaging: TapeAndReel; PartId: 27715; Part Status: Active; Price: 0.09; Ratings: AEC-Q200; Resistance: 1 kOhms; Series: RNCS; Size / Dimension: 0.079" L x 0.049" W (2.00mm x 1.25mm); Supplier 1: DigiKey; Supplier Part Number 1: RNCS0805BKE1K00CT-ND; Supplier Device Package: 0805; Tolerance: ±0.1%

## Sheet GatesDriver.SchDoc
size A4
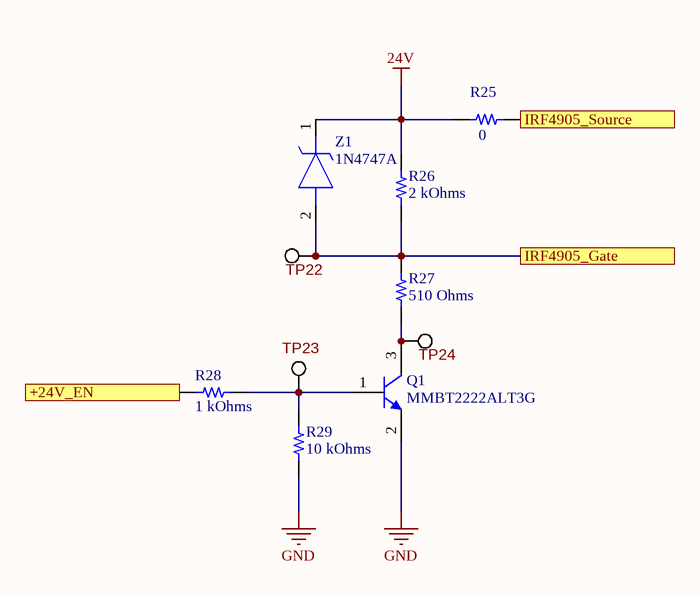
[diagram p7: GatesDriver.SchDoc]

### Parts
Q1  MMBT2222ALT3G  [ON SEMI SOT-23-3]
R25  0  [RES 0805_2012]
R26  2 kOhms  [RES 0805_2012]
R27  510 Ohms  [RES 0805_2012]
R28  1 kOhms  [RES 0805_2012]
R29  10 kOhms  [RES 0805_2012]
TP22  PAD-1.1mm  [PAD-1.1mm]  (value not drawn)  (no BOM)
TP23  PAD-1.1mm  [PAD-1.1mm]  (value not drawn)  (no BOM)
TP24  PAD-1.1mm  [PAD-1.1mm]  (value not drawn)  (no BOM)
Z1  1N4747A  [DIOAD1310W86L370D235]

### Ports
+24V_EN, IRF4905_Gate, IRF4905_Source

### Nets
24V: R25.1 R26.2 Z1.1(K)
GND: Q1.2(E) R29.1
c24V_EN: R28.1 ; port +24V_EN
NetQ1_1: Q1.1(B) R28.2 R29.2 TP23.1
NetQ1_3: Q1.3(C) R27.1 TP24.1
NetR25_2: R25.2 ; port IRF4905_Source
NetR26_1: R26.1 R27.2 TP22.1 Z1.2(A) ; port IRF4905_Gate

### Library data of the parts
Q1 = MMBT2222ALT3G: TRANS NPN 40V 0.6A SOT-23; Manufacturer: ON Semiconductor; Current - Collector Cutoff (Max): 10nA (ICBO); Current - Collector (Ic) (Max): 600mA; DC Current Gain (hFE) (Min) @ Ic, Vce: 100 @ 150mA, 10V; Frequency - Transition: 300MHz; Power - Max: 300mW; Vce Saturation (Max) @ Ib, Ic: 1V @ 50mA, 500mA; Part Number: MMBT2222ALT3G; ComponentLink1Description: Datasheet; ComponentLink1URL: http://www.onsemi.com/pub/Collateral/MMBT2222LT1-D.PDF; ComponentLink2Description: DigiKey Link; ComponentLink2URL: http://digikey.com/product-detail/en/on-semiconductor/MMBT2222ALT3G/MMBT2222ALT3GOSCT-ND/1967145; LastUpdated: 02.09.2020 01:30:08; Lifecycle Status: Active; Minimum Order: 1; Mounting Type: Surface Mount; Operating Temperature: -55°C ~ 150°C (TJ); Package / Case: TO-236-3, SC-59, SOT-23-3; Packaging: TapeAndReel; PartId: 156; Part Status: Active; Price: 0.02; Series: -; Supplier 1: DigiKey; Supplier Part Number 1: MMBT2222ALT3GOSCT-ND; Supplier Device Package: SOT-23-3 (TO-236); Transistor Type: NPN; Voltage - Collector Emitter Breakdown (Max): 40V
R25 = TLRZ2ATTD: RES 0 OHM JUMPER 0805; Manufacturer: KOA Speer Electronics, Inc.; Part Number: TLRZ2ATTD; ComponentLink1Description: Datasheet; ComponentLink1URL: http://www.koaspeer.com/catimages/Products/TLRZ/TLRZ.pdf; ComponentLink2Description: DigiKey Link; ComponentLink2URL: http://digikey.com/product-detail/en/koa-speer-electronics-inc/TLRZ2ATTD/2019-TLRZ2ATTDCT-ND/9847538; Composition: Metal Element; Device Package: 0805 (2012 Metric); Features: Automotive AEC-Q200, Current Sense; Height - Seated (Max): 0.022" (0.55mm); LastUpdated: 02.09.2020 01:15:24; Lifecycle Status: Active; Minimum Order: 1; Number of Terminations: 2; Operating Temperature: -55°C ~ 170°C; Package / Case: 0805 (2012 Metric); Packaging: TapeAndReel; PartId: 27685; Part Status: Active; Price: 0.09; Ratings: AEC-Q200; Series: TLRZ; Size / Dimension: 0.079" L x 0.049" W (2.00mm x 1.25mm); Supplier 1: DigiKey; Supplier Part Number 1: 2019-TLRZ2ATTDCT-ND; Supplier Device Package: 0805; Tolerance: Jumper
R26 = RCS08052K00FKEA: as R10 on sheet Power; Part Number: RCS08052K00FKEA; Value: 2 kOhms; ComponentLink1Description: Datasheet; ComponentLink1URL: http://www.vishay.com/docs/20065/rcse3.pdf; ComponentLink2Description: DigiKey Link; ComponentLink2URL: http://digikey.com/product-detail/en/vishay-dale/RCS08052K00FKEA/541-2840-1-ND/5867133; Composition: Thick Film; Device Package: 0805 (2012 Metric); Features: Automotive AEC-Q200, Pulse Withstanding; Height - Seated (Max): 0.020" (0.50mm); LastUpdated: 02.09.2020 01:15:24; Lifecycle Status: Active; Minimum Order: 1; Number of Terminations: 2; Operating Temperature: -55°C ~ 155°C; Package / Case: 0805 (2012 Metric); Packaging: TapeAndReel; PartId: 27786; Part Status: Active; Price: 0.03; Ratings: AEC-Q200; Resistance: 2 kOhms; Series: RCS e3; Size / Dimension: 0.079" L x 0.049" W (2.00mm x 1.25mm); Supplier 1: DigiKey; Supplier Part Number 1: 541-2840-1-ND; Supplier Device Package: 0805; Tolerance: ±1%
R27 = ERA-6APB511V: RES 510 OHM 0.1% 1/8W 0805; Manufacturer: Panasonic Electronic Components; Power (Watts): 0.125W, 1/8W; Temperature Coefficient: ±15ppm/°C; Part Number: ERA-6APB511V; Value: 510 Ohms; ComponentLink1Description: Datasheet; ComponentLink1URL: https://industrial.panasonic.com/cdbs/www-data/pdf/RDM0000/AOA0000C307.pdf; ComponentLink2Description: DigiKey Link; ComponentLink2URL: http://digikey.com/product-detail/en/panasonic-electronic-components/ERA-6APB511V/P510AZCT-ND/3069493; Composition: Thin Film; Device Package: 0805 (2012 Metric); Features: Automotive AEC-Q200; Height - Seated (Max): 0.024" (0.60mm); LastUpdated: 02.09.2020 01:15:21; Lifecycle Status: Active; Minimum Order: 1; Number of Terminations: 2; Operating Temperature: -55°C ~ 155°C; Package / Case: 0805 (2012 Metric); Packaging: TapeAndReel; PartId: 29321; Part Status: Active; Price: 0.17; Ratings: AEC-Q200; Resistance: 510 Ohms; Series: ERA-6A; Size / Dimension: 0.079" L x 0.049" W (2.00mm x 1.25mm); Supplier 1: DigiKey; Supplier Part Number 1: P510AZCT-ND; Supplier Device Package: 0805; Tolerance: ±0.1%
R28 = RNCS0805BKE1K00: as R18 on sheet FusesControl; Part Number: RNCS0805BKE1K00; Value: 1 kOhms; ComponentLink1Description: Datasheet; ComponentLink1URL: https://www.seielect.com/catalog/sei-rncs_rnch.pdf; ComponentLink2Description: DigiKey Link; ComponentLink2URL: http://digikey.com/product-detail/en/stackpole-electronics-inc/RNCS0805BKE1K00/RNCS0805BKE1K00CT-ND/1800170; Composition: Thin Film; Device Package: 0805 (2012 Metric); Features: Anti-Corrosive, Automotive AEC-Q200, Moisture Resistant; Height - Seated (Max): 0.026" (0.65mm); LastUpdated: 02.09.2020 01:15:24; Lifecycle Status: Active; Minimum Order: 1; Number of Terminations: 2; Operating Temperature: -55°C ~ 155°C; Package / Case: 0805 (2012 Metric); Packaging: TapeAndReel; PartId: 27715; Part Status: Active; Price: 0.09; Ratings: AEC-Q200; Resistance: 1 kOhms; Series: RNCS; Size / Dimension: 0.079" L x 0.049" W (2.00mm x 1.25mm); Supplier 1: DigiKey; Supplier Part Number 1: RNCS0805BKE1K00CT-ND; Supplier Device Package: 0805; Tolerance: ±0.1%
R29 = RNCS0805BKE10K0: RES 10K OHM 0.1% 1/10W 0805; Manufacturer: Stackpole Electronics Inc; Power (Watts): 0.1W, 1/10W; Temperature Coefficient: ±25ppm/°C; Part Number: RNCS0805BKE10K0; Value: 10 kOhms; ComponentLink1Description: Datasheet; ComponentLink1URL: https://www.seielect.com/catalog/sei-rncs_rnch.pdf; ComponentLink2Description: DigiKey Link; ComponentLink2URL: http://digikey.com/product-detail/en/stackpole-electronics-inc/RNCS0805BKE10K0/RNCS0805BKE10K0CT-ND/1800164; Composition: Thin Film; Device Package: 0805 (2012 Metric); Features: Anti-Corrosive, Automotive AEC-Q200, Moisture Resistant; Height - Seated (Max): 0.026" (0.65mm); LastUpdated: 02.09.2020 01:15:24; Lifecycle Status: Active; Minimum Order: 1; Number of Terminations: 2; Operating Temperature: -55°C ~ 155°C; Package / Case: 0805 (2012 Metric); Packaging: TapeAndReel; PartId: 27713; Part Status: Active; Price: 0.09; Ratings: AEC-Q200; Resistance: 10 kOhms; Series: RNCS; Size / Dimension: 0.079" L x 0.049" W (2.00mm x 1.25mm); Supplier 1: DigiKey; Supplier Part Number 1: RNCS0805BKE10K0CT-ND; Supplier Device Package: 0805; Tolerance: ±0.1%
TP22-TP24 = PAD-1.1mm: as TP8 on sheet Power; Lifecycle: ="Lifecycle"; Part Number: PAD-1.1mm; Component Type: PTH; Manufacturer: NONE; Part Type: Pad; Temperature Range: NONE; ComponentLink1URL: NONE; Replacement: NONE; Price: NONE; ComponentLink1Description: Datasheet
Z1 = 1N4747A: Zener Diode; Manufacturer_Name: Good-Ark; Datasheet Link: https://www.mouser.in/datasheet/2/308/1N4736AT_D-2309095.pdf; Manufacturer_Part_Number: 1N4747A; Arrow Part Number: 1N4747A; Arrow Price/Stock: https://www.arrow.com/en/products/1n4747a/good-ark-semiconductor?region=nac

## Sheet NTC_MUX.SchDoc
size A4
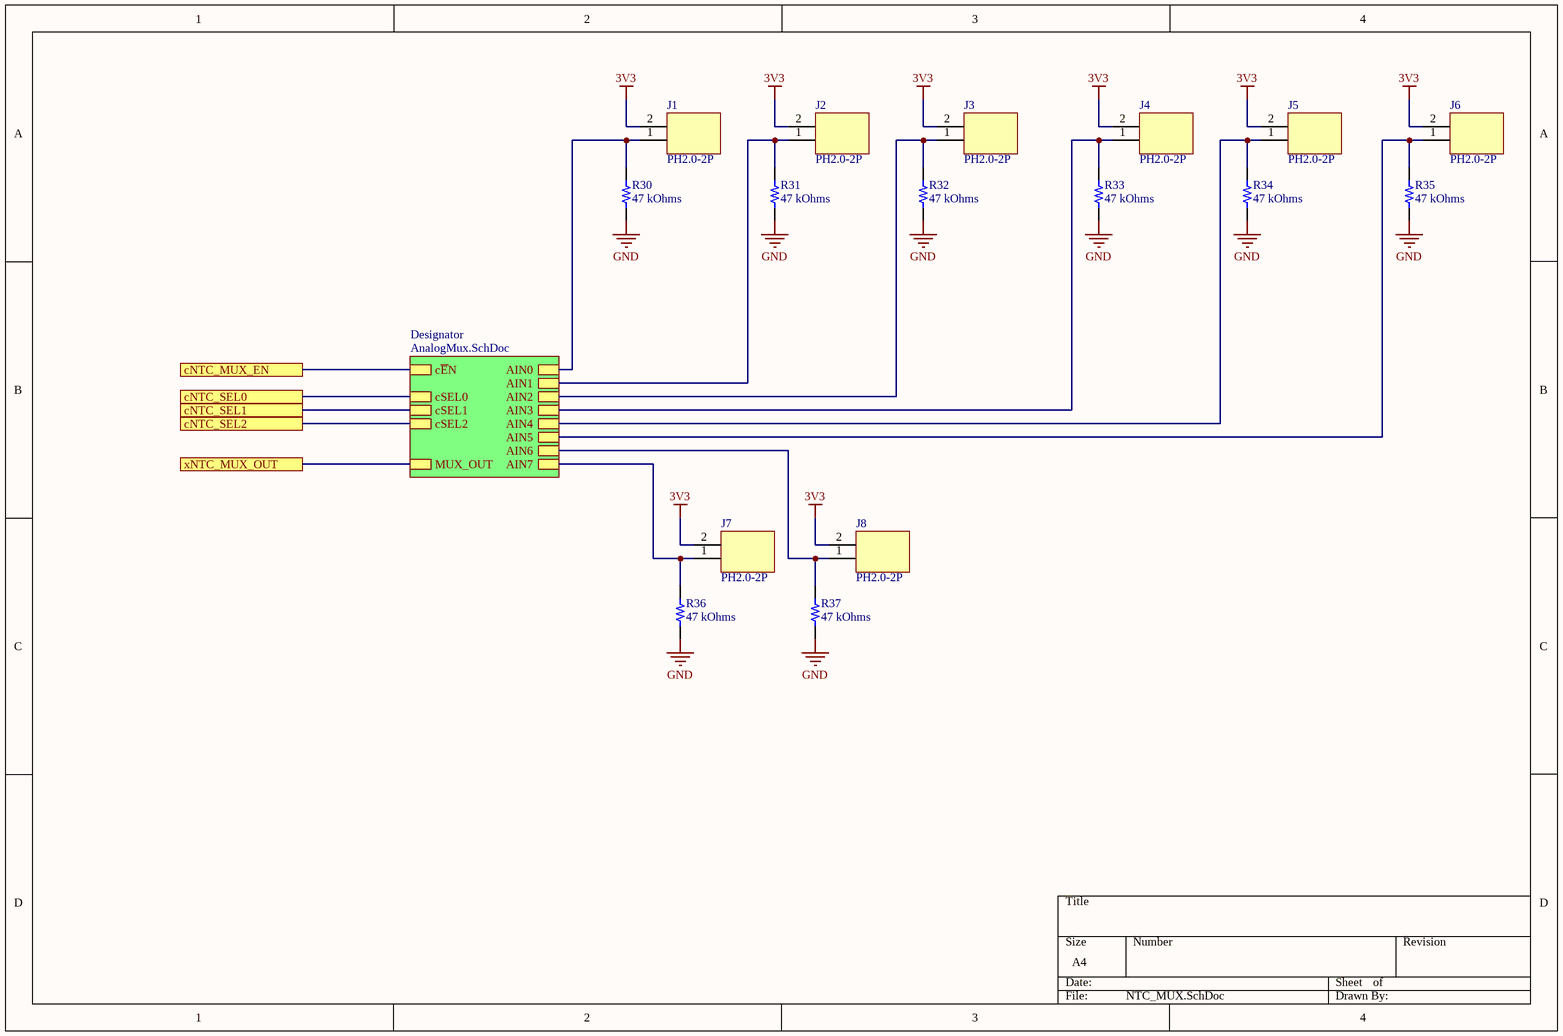
[diagram p8: NTC_MUX.SchDoc]

### Parts
J1  PH2.0-2P  [PH2.0-2P]
J2  PH2.0-2P  [PH2.0-2P]
J3  PH2.0-2P  [PH2.0-2P]
J4  PH2.0-2P  [PH2.0-2P]
J5  PH2.0-2P  [PH2.0-2P]
J6  PH2.0-2P  [PH2.0-2P]
J7  PH2.0-2P  [PH2.0-2P]
J8  PH2.0-2P  [PH2.0-2P]
R30  47 kOhms  [RES 0805_2012]
R31  47 kOhms  [RES 0805_2012]
R32  47 kOhms  [RES 0805_2012]
R33  47 kOhms  [RES 0805_2012]
R34  47 kOhms  [RES 0805_2012]
R35  47 kOhms  [RES 0805_2012]
R36  47 kOhms  [RES 0805_2012]
R37  47 kOhms  [RES 0805_2012]

### Sub-sheets
Designator = AnalogMux.SchDoc: cSEL1, AIN7, AIN1, AIN0, MUX_OUT, AIN6, cSEL0, AIN4, AIN5, AIN3, AIN2, cSEL2, c~{E}N

### Ports
cNTC_MUX_EN, cNTC_SEL0, cNTC_SEL1, cNTC_SEL2, xNTC_MUX_OUT

### Nets
3V3: J1.2 J2.2 J3.2 J4.2 J5.2 J6.2 J7.2 J8.2
GND: R30.1 R31.1 R32.1 R33.1 R34.1 R35.1 R36.1 R37.1
cNTC_MUX_EN: port cNTC_MUX_EN, sheet Designator/c~{E}N
cNTC_SEL0: port cNTC_SEL0, sheet Designator/cSEL0
cNTC_SEL1: port cNTC_SEL1, sheet Designator/cSEL1
cNTC_SEL2: port cNTC_SEL2, sheet Designator/cSEL2
PA1: port xNTC_MUX_OUT, sheet Designator/MUX_OUT
NetJ1_1: J1.1 R30.2 ; sheet Designator/AIN0
NetJ2_1: J2.1 R31.2 ; sheet Designator/AIN1
NetJ3_1: J3.1 R32.2 ; sheet Designator/AIN2
NetJ4_1: J4.1 R33.2 ; sheet Designator/AIN3
NetJ5_1: J5.1 R34.2 ; sheet Designator/AIN4
NetJ6_1: J6.1 R35.2 ; sheet Designator/AIN5
NetJ7_1: J7.1 R36.2 ; sheet Designator/AIN7
NetJ8_1: J8.1 R37.2 ; sheet Designator/AIN6

### Library data of the parts
R30-R37 = RT0805DRD0747KL: RES SMD 47K OHM 0.5% 1/8W 0805; Manufacturer: Yageo; Power (Watts): 0.125W, 1/8W; Temperature Coefficient: ±25ppm/°C; Part Number: RT0805DRD0747KL; Value: 47 kOhms; ComponentLink1Description: Datasheet; ComponentLink1URL: https://www.yageo.com/upload/media/product/productsearch/datasheet/rchip/PYu-RT_1-to-0.01_RoHS_L_11.pdf; ComponentLink2Description: DigiKey Link; ComponentLink2URL: http://digikey.com/product-detail/en/yageo/RT0805DRD0747KL/311-2747-1-ND/6129166; Composition: Thin Film; Device Package: 0805 (2012 Metric); Height - Seated (Max): 0.024" (0.60mm); LastUpdated: 02.09.2020 01:15:24; Lifecycle Status: Active; Minimum Order: 1; Number of Terminations: 2; Operating Temperature: -55°C ~ 155°C; Package / Case: 0805 (2012 Metric); Packaging: TapeAndReel; PartId: 27804; Part Status: Active; Price: 0.03; Resistance: 47 kOhms; Series: RT; Size / Dimension: 0.079" L x 0.049" W (2.00mm x 1.25mm); Supplier 1: DigiKey; Supplier Part Number 1: 311-2747-1-ND; Supplier Device Package: 0805; Tolerance: ±0.5%